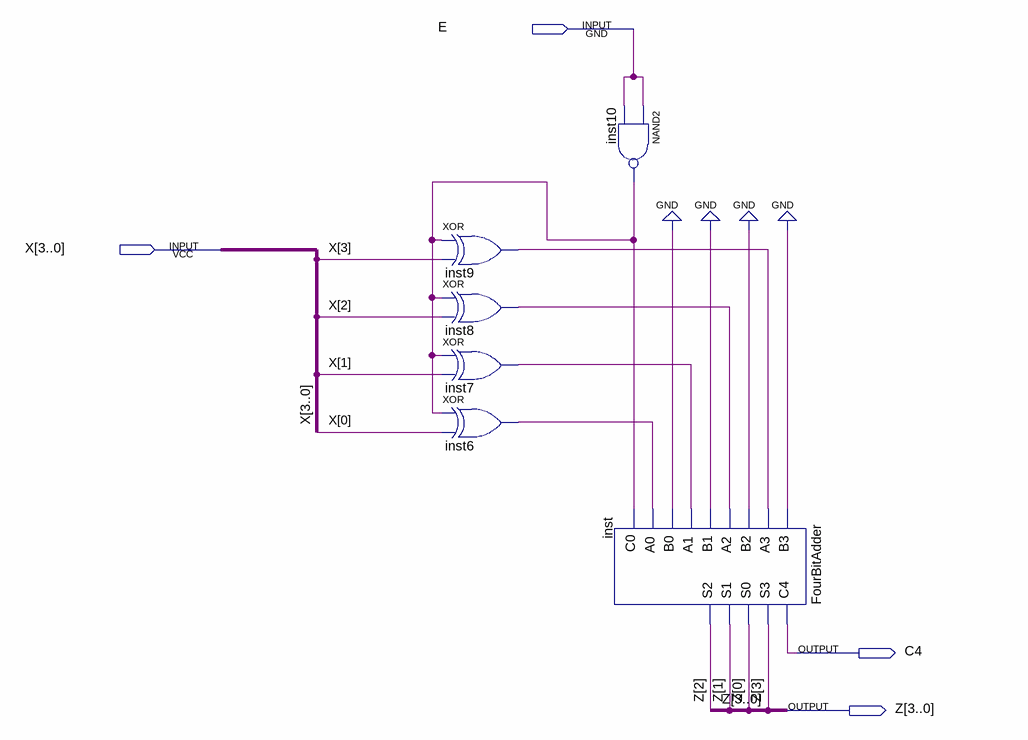
[diagram p0: schematic sheet]
// Quartus schematic Complementer.bdf as structural Verilog: 6 symbols, 4 pins
module Complementer (
  input  E,
  input  [3:0] X,
  output C4,
  output [3:0] Z
);

  wire inst6_out, inst7_out, inst8_out, inst9_out, inst10_out;

  xor inst9 (inst9_out, inst10_out, X[3]);
  xor inst8 (inst8_out, inst10_out, X[2]);
  xor inst7 (inst7_out, inst10_out, X[1]);
  xor inst6 (inst6_out, inst10_out, X[0]);
  nand inst10 (inst10_out, E, E);
  FourBitAdder inst (
    .B3(1'b0), .A3(inst9_out), .B2(1'b0), .A2(inst8_out), .B1(1'b0), .A1(inst7_out), .B0(1'b0),
    .A0(inst6_out), .C0(inst10_out), .C4(C4), .S3(Z[3]), .S0(Z[0]), .S1(Z[1]), .S2(Z[2]));
endmodule
